# EAGLE design CameraV2 (EAGLE 9.0.0)
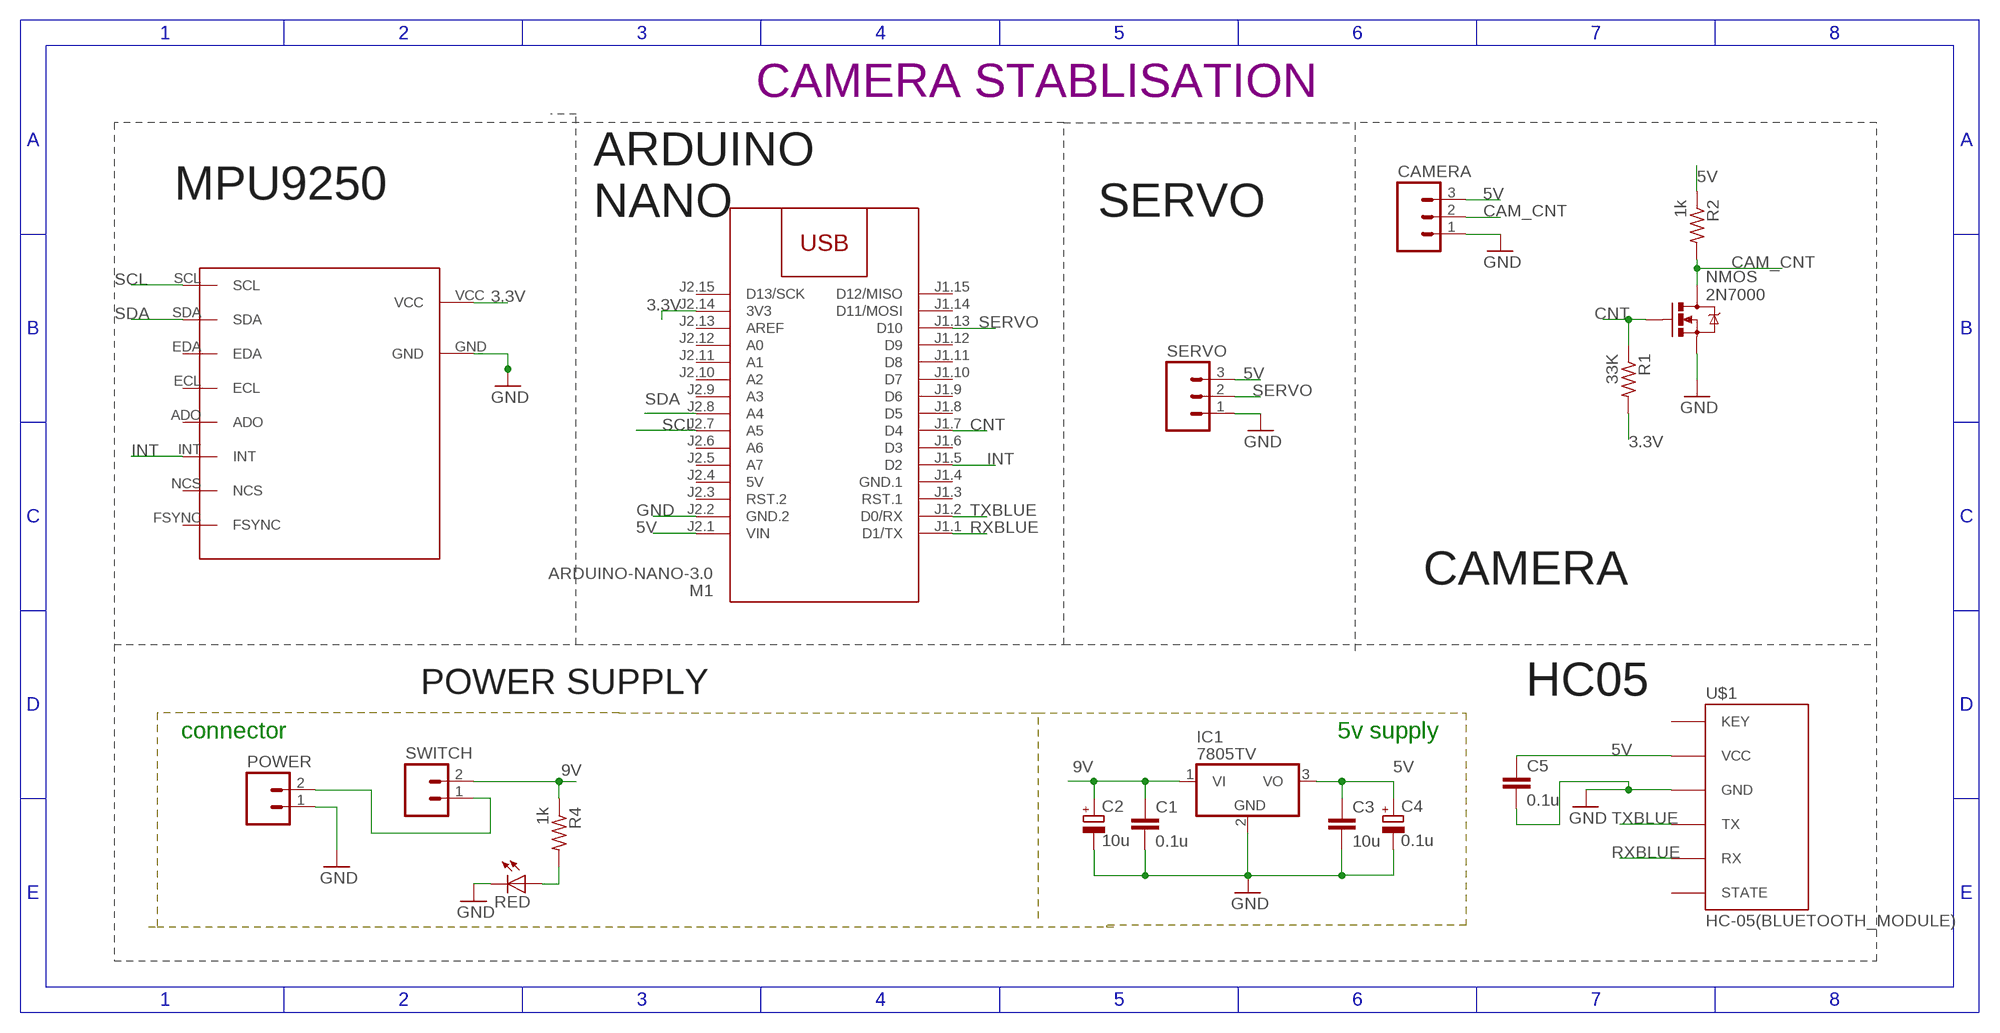
[diagram p0: schematic, sheet 1]

## Parts
C1  0.1u  C-EU025-025X050  [C025-025X050]
C2  10u  CPOL-EUE2.5-6  [E2,5-6]
C3  10u  C-EU025-025X050  [C025-025X050]
C4  0.1u  CPOL-EUE2.5-6  [E2,5-6]
C5  0.1u  C-EU025-025X050  [C025-025X050]
CAMERA  CON-AMP-QUICK_M03  [CON-AMP-QUICK_03P]
IC1  7805TV  [TO220V]
M1  ARDUINO-NANO-3.0  [ARDUINO-NANO-3.0]
POWER  CEDT_JANUARY_2015_V5_M02  [CEDT_JANUARY_2015_V5_02P]
Q1  SPARKFUN-DISCRETESEMI_MOSFET-NCHANNEL2N7000  [SPARKFUN-DISCRETESEMI_TO-92]
R1  33K  R-US_0204/7  [0204/7]
R2  1k  R-US_0204/7  [0204/7]
R4  1k  R-US_0204/7  [0204/7]
RED  red  LED3MM  [LED3MM]
SERVO  CON-AMP-QUICK_M03  [CON-AMP-QUICK_03P]
SWITCH  M02  [02P]
U$1  HC-05(BLUETOOTH_MODULE)  [HC-05]
U$2  MPU9250  [MPU9250]

## Nets
3.3V [power]: M1.J2.14(3V3) R1.2 U$2.VCC
5V [power]: C3.1 C4.+ C5.1 CAMERA.3 IC1.3(VO) M1.J2.1(VIN) R2.1 SERVO.3 U$1.VCC
9V [power]: C1.1 C2.+ IC1.1(VI) R4.1 SWITCH.2
CAM_CNT: CAMERA.2 Q1.3(D) R2.2
CNT: M1.J1.7(D4) Q1.2(G) R1.1
GND [power]: C1.2 C2.- C3.2 C4.- C5.2 CAMERA.1 IC1.2(GND) M1.J2.2(GND.2) POWER.1 Q1.1(S) RED.K(C) SERVO.1 U$1.GND U$2.GND
INT: M1.J1.5(D2) U$2.INT
N$1 [power]: POWER.2 SWITCH.1
N$2: R4.2 RED.A
RXBLUE: M1.J1.1(D1/TX) U$1.RX
SCL: M1.J2.7(A5) U$2.SCL
SDA: M1.J2.8(A4) U$2.SDA
SERVO: M1.J1.13(D10) SERVO.2
TXBLUE: M1.J1.2(D0/RX) U$1.TX
Unconnected: M1.J1.3(RST.1) M1.J1.6(D3) M1.J1.8(D5) M1.J1.9(D6) M1.J1.10(D7) M1.J1.11(D8) M1.J1.12(D9) M1.J1.14(D11/MOSI) M1.J1.15(D12/MISO) M1.J2.3(RST.2) M1.J2.5(A7) M1.J2.6(A6) M1.J2.9(A3) M1.J2.10(A2) M1.J2.11(A1) M1.J2.12(A0) M1.J2.13(AREF) M1.J2.15(D13/SCK) U$1.KEY U$1.STATE U$2.ADO U$2.ECL U$2.EDA U$2.FSYNC U$2.NCS

## Notes on the sheet
- CAMERA STABLISATION
- MPU9250
- ARDUINO
  NANO
- SERVO
- CAMERA
- POWER SUPPLY | HC05
- connector | 5v supply

## Power pins joined to a net without a drawn wire
5V: M1.J2.4(5V)
GND.1: M1.J1.4(GND.1)

## Library data of the parts
C1 C3 C5 = resistor:C-EU: CAPACITOR, European symbol
C2 C4 = rcl:CPOL-EU: POLARIZED CAPACITOR, European symbol; SPICEPREFIX: C
CAMERA SERVO = ADC_CPLDV8:CON-AMP-QUICK_M03: AMP QUICK CONNECTOR; OC_FARNELL: unknown; OC_NEWARK: unknown
IC1 = linear:78*: Positive VOLTAGE REGULATOR Source: http://cache.national.com/ds/LM/LM78L05.pdf http://www.fairchildsemi.com/ds/LM/LM7805.pdf
M1 = diy-modules:ARDUINO-NANO-3.0: Arduino Nano 3.0 and compatible devices More details available here: https://www.arduino.cc/en/Main/ArduinoBoardNano Click here to find device on ebay.com <http://www.ebay.com/sch/arduino+nano>
POWER = Cansat2019_3279_Container_v01:CEDT_JANUARY_2015_V5_M02: AMP QUICK CONNECTOR
Q1 = Cansat2019_3279_Container_v01:SPARKFUN-DISCRETESEMI_MOSFET-NCHANNEL: Common NMOSFET Parts MFG P/N Store ID Prod ID FDD8780 TRANS-09984 SI7820DN TRANS-11055 FDS6630A IC-08089 2N7002PW TRANS-11151 FQP30N06L COM-10213 TRANS-10060 BSS123LT1G TRANS-08345 BSS138 TRANS-00830 BS170 2N7000
R1 R2 R4 = rcl:R-US_: RESISTOR, American symbol; SPICEPREFIX: R
RED = CEDT_JANUARY_2015_v5:LED
SWITCH = CEDT_JANUARY_2015_v5:M02: AMP QUICK CONNECTOR
U$1 = CEDT_JANUARY_2015_v5:HC-05(BLUETOOTH_MODULE)
U$2 = mylib:MPU9250

## Net classes
0 default: width 0.406 mm
1 power: width 0.61 mm

## Board
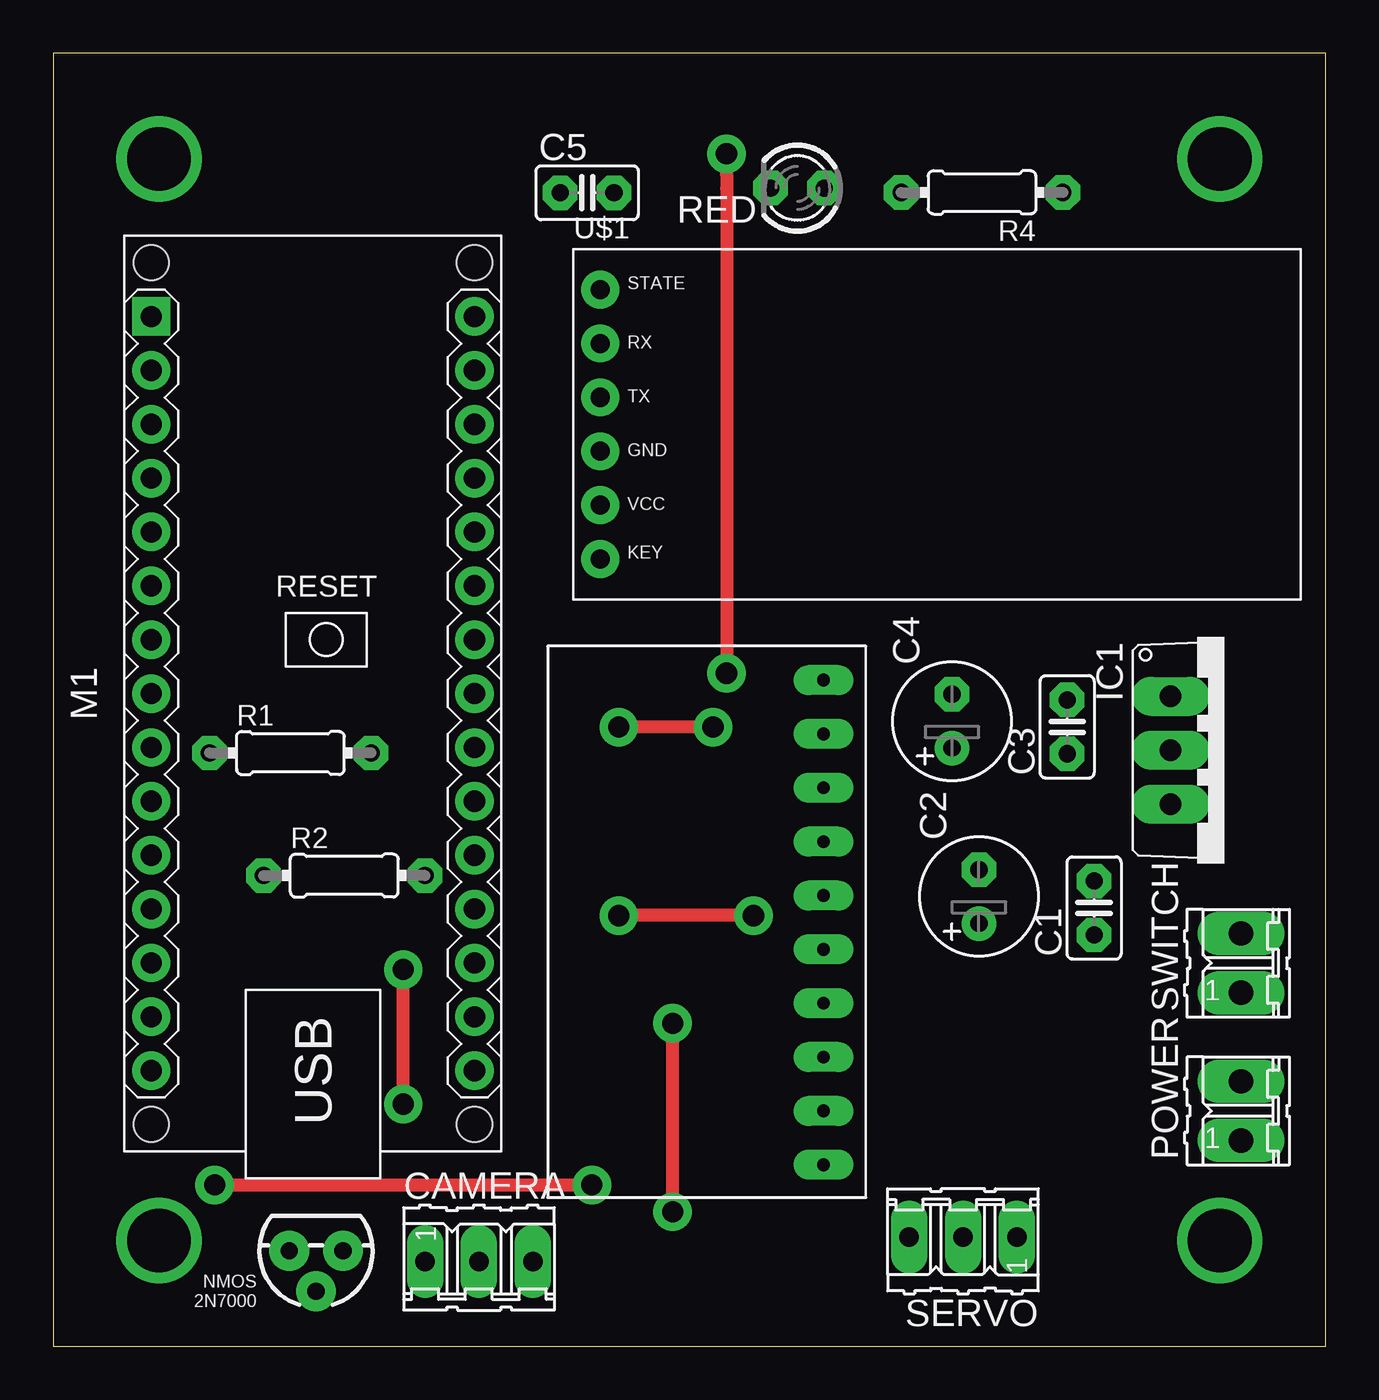
[diagram p1: board, top side]
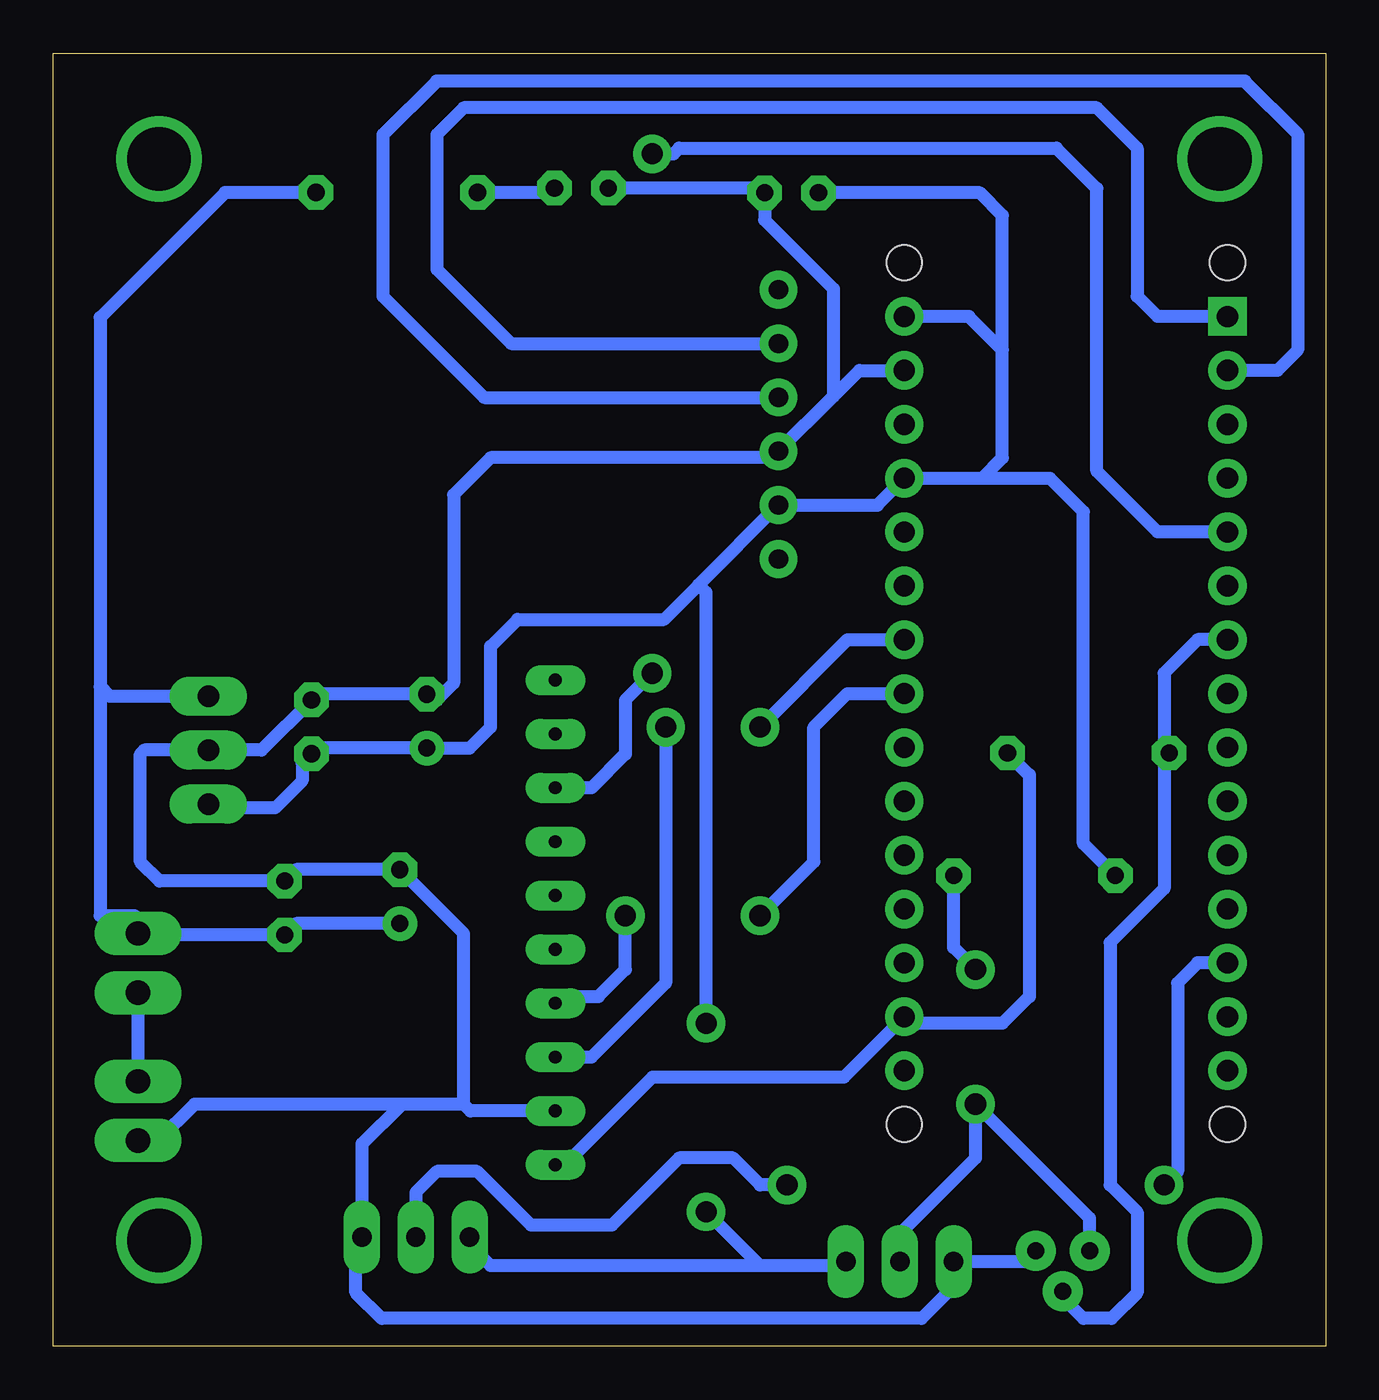
[diagram p2: board, bottom side, seen from below]

Size 60 x 61 mm. Coordinates in mm from the lower left corner, seen from the top.
Outline: 0,0 60,0 60,61 0,61 0,0
Copper layers (1*16): Top 0.035mm / dielectric 1.5mm / Bottom 0.035mm
Design rules "default *": minimum track width 6mil, minimum drill 0.35mm, track to track 16mil, track to pad 16mil, pad to pad 16mil, via to via 16mil, smd to smd 16mil, copper to edge 40mil, drill to drill 6mil, minimum pad ring 16mil, minimum via ring 16mil, stop-mask expansion 4mil, vias tented up to drill 0mil, thermal gap 10mil

### Footprints (pad centres in the part's own frame; a part is rotated, then mirrored left to right if it is on the bottom)
C025-025X050 = drill 0.813 octagon: 1 -1.27,0; 2 1.27,0
E2,5-6 = drill 0.813 pad 1.6: + -1.27,0 | drill 0.813 pad 1.6 octagon: - 1.27,0
CON-AMP-QUICK_03P = drill 0.914 long: 1 -2.54,0; 2 0,0; 3 2.54,0
TO220V = drill 1.016 long: 1 -2.54,-2.54; 2 0,-2.54; 3 2.54,-2.54
ARDUINO-NANO-3.0 = drill 1 square: J1.1 17.78,7.62 | drill 1: J1.2 15.24,7.62; J1.3 12.7,7.62; J1.4 10.16,7.62; J1.5 7.62,7.62; J1.6 5.08,7.62; J1.7 2.54,7.62; J1.8 0,7.62; J1.9 -2.54,7.62; J1.10 -5.08,7.62; J1.11 -7.62,7.62; J1.12 -10.16,7.62; J1.13 -12.7,7.62; J1.14 -15.24,7.62; J1.15 -17.78,7.62; J2.1 17.78,-7.62; J2.2 15.24,-7.62; J2.3 12.7,-7.62; J2.4 10.16,-7.62; J2.5 7.62,-7.62; J2.6 5.08,-7.62; J2.7 2.54,-7.62; J2.8 0,-7.62; J2.9 -2.54,-7.62; J2.10 -5.08,-7.62; J2.11 -7.62,-7.62; J2.12 -10.16,-7.62; J2.13 -12.7,-7.62; J2.14 -15.24,-7.62; J2.15 -17.78,-7.62 | hole 1.651: -20.32,7.62; -20.32,-7.62; 20.32,-7.62; 20.32,7.62
CEDT_JANUARY_2015_V5_02P = drill 1.143 long: 1 -1.397,0; 2 1.397,0
SPARKFUN-DISCRETESEMI_TO-92 = drill 0.813 pad 1.88: 1 -1.27,0; 2 0,1.905; 3 1.27,0
0204/7 = drill 0.813 octagon: 1 -3.81,0; 2 3.81,0
LED3MM = drill 0.813 octagon: A -1.27,0; K 1.27,0
02P = drill 1.143 long: 1 -1.397,0; 2 1.397,0
HC-05 = drill 0.9 pad 1.778: GND -16.51,-1.27; KEY -16.51,-6.35; RX -16.51,3.81; STATE -16.51,6.35; TX -16.51,1.27; VCC -16.51,-3.81
MPU9250 = drill 0.6 long: ADO 16.78,0; ECL 14.24,0; EDA 11.7,0; FSYNC 24.4,0; GND 4.08,0; INT 19.32,0; NCS 21.86,0; SCL 6.62,0; SDA 9.16,0; VCC 1.54,0

### Placement (x,y rotation side)
C1  49.08,20.68 90 top
C2  43.65,21.22 90 top
C3  47.81,29.22 90 top
C4  42.38,29.49 90 top
C5  25.18,54.41 0 top
CAMERA  20.08,4 0 top
IC1  55.22,28.12 270 top
M1  12.25,30.79 90 top
POWER  56,11.11 90 top
Q1  12.4,4.51 180 top
R1  11.19,27.99 0 top
R2  13.73,22.21 0 top
R4  43.8,54.42 180 top
RED  35.09,54.63 180 top
SERVO  42.9,5.16 180 top
SWITCH  56,18.08 90 top
U$1  42.31,43.49 0 top
U$2  36.32,7.03 90 top

### Tracks (layer width: path | path; a pad name or v marks a point on that pad's centre or on a via)
3.3V
  Bottom 0.61: R1.2 13.97,26.96 13.97,16.51 15.24,15.24 19.56,15.24 M1.J2.14 | M1.J2.14 20.01,15.55 | M1.J2.14 22.72,12.7 31.75,12.7 35.88,8.57 U$2.VCC
5V  (via drill 1)
  Top 0.61: v29.21,6.35 v29.21,15.24
  Bottom 0.61: U$1.VCC 21.14,39.68 M1.J2.4 16.2,40.95 | 16.2,40.95 15.24,41.91 15.24,46.99 | M1.J2.1 16.82,48.57 15.24,46.99 | 15.24,46.99 15.24,53.34 16.31,54.41 C5.1 | U$1.VCC 26.11,39.37 | CAMERA.3 22.81,3.81 26.67,3.81 | 26.67,3.81 39.37,3.81 40.36,4.8 SERVO.3 | 16.2,40.95 13.01,40.95 11.43,39.37 11.43,23.72 R2.1 | U$1.VCC 29.57,35.91 | 29.57,35.91 31.19,34.29 38.1,34.29 39.37,33.02 39.37,29.21 40.36,28.22 C4.+ 47.54,28.22 C3.1 48.26,27.5 48.26,26.67 49.53,25.4 52.86,25.4 | 26.67,3.81 v29.21,6.35 | v29.21,15.24 29.21,35.56 29.57,35.91 | 53.34,25.4 52.86,25.4 | 52.86,25.4 IC1.3
9V
  Bottom 0.61: 57.15,20.32 56.31,19.48 SWITCH.2 55.93,19.41 55.24,19.41 | R4.1 51.88,54.42 57.78,48.52 57.78,31.11 | 55.24,19.41 C1.1 48.54,19.95 C2.+ | 57.78,31.11 57.78,20.32 56.16,20.32 55.24,19.41 | IC1.1 57.33,30.66 57.78,31.11
CAM_CNT  (via drill 1)
  Top 0.61: v16.51,11.43 v16.51,17.78
  Bottom 0.61: Q1.3 11.13,6.05 v16.51,11.43 16.51,8.89 20.08,5.32 CAMERA.2 | v16.51,17.78 17.54,18.81 R2.2
CNT
  Bottom 0.61: M1.J1.7 6.04,33.33 7.62,31.75 7.62,27.94 7.43,27.94 R1.1 7.62,27.75 7.62,21.59 10.16,19.05 10.16,7.62 8.89,6.35 8.89,2.54 10.11,1.32 11.43,1.32 12.4,2.29 Q1.2
GND
  Bottom 0.61: RED.K 26.67,54.63 C5.2 26.45,53.12 23.21,49.88 23.21,44.8 | 23.21,44.8 U$1.GND 26.11,41.91 39.37,41.91 41.11,40.17 41.11,31.28 41.91,30.48 42.19,30.76 C4.- 47.54,30.76 C3.2 50.18,28.12 IC1.2 55.7,28.12 55.88,27.94 55.88,22.86 54.97,21.95 C1.2 48.54,22.49 C2.- 40.64,19.48 40.64,11.43 | 23.21,44.8 21.99,46.03 M1.J2.2 | CAMERA.1 17.78,4.24 | Q1.1 14.18,4 CAMERA.1 | CAMERA.1 17.78,3.76 | CAMERA.1 17.54,2.83 19.05,1.32 44.5,1.32 45.72,2.54 45.72,5.44 SERVO.1 45.44,9.56 43.57,11.43 | POWER.1 55.06,9.71 53.34,11.43 43.57,11.43 | U$2.GND 40.32,11.11 40.64,11.43 | 40.64,11.43 43.57,11.43
INT  (via drill 1)
  Top 0.61: v31.75,31.75 31.75,54.61 31.75,55.24 v31.75,56.25
  Bottom 0.61: M1.J1.5 7.93,38.41 10.79,41.27 10.79,54.61 12.7,56.52 30.48,56.52 30.75,56.25 v31.75,56.25 | v31.75,31.75 33.02,30.48 33.02,27.94 34.61,26.35 U$2.INT
N$1
  Bottom 0.61: SWITCH.1 POWER.2
N$2
  Bottom 0.61: RED.A 36.56,54.42 R4.2
N$3  (via drill 3)
  other vias: 5,5
N$4  (via drill 3)
  other vias: 55,5
N$5  (via drill 3)
  other vias: 55,56
N$6  (via drill 3)
  other vias: 5,56
RXBLUE
  Bottom 0.61: U$1.RX 38.41,47.3 41.91,50.8 41.91,57.15 40.64,58.42 10.79,58.42 8.89,56.52 8.89,49.53 7.93,48.57 M1.J1.1
SCL  (via drill 1)
  Top 0.61: v31.11,29.21 v26.67,29.21
  Bottom 0.61: v26.67,29.21 22.55,33.33 M1.J2.7 | v31.11,29.21 31.11,17.14 34.61,13.65 U$2.SCL
SDA  (via drill 1)
  Top 0.61: v33.02,20.32 v26.67,20.32
  Bottom 0.61: U$2.SDA 36,16.51 34.29,16.51 33.02,17.78 v33.02,20.32 | v26.67,20.32 24.13,22.86 24.13,29.21 22.55,30.79 M1.J2.8
SERVO  (via drill 1)
  Top 0.61: v7.62,7.62 v25.4,7.62
  Bottom 0.61: M1.J1.13 6.04,18.09 6.99,17.14 6.99,8.26 v7.62,7.62 | v25.4,7.62 26.67,7.62 27.94,8.89 30.48,8.89 33.66,5.71 37.47,5.71 40.01,8.26 41.91,8.26 42.9,7.26 SERVO.2
TXBLUE
  Bottom 0.61: U$1.TX 39.68,44.76 44.45,49.53 44.45,57.15 41.92,59.68 3.81,59.68 1.32,57.19 1.32,46.99 2.28,46.03 M1.J1.2